# EAGLE design L1Demoscene_v2 (EAGLE 6.5.0)

## Sheet 1 of 2
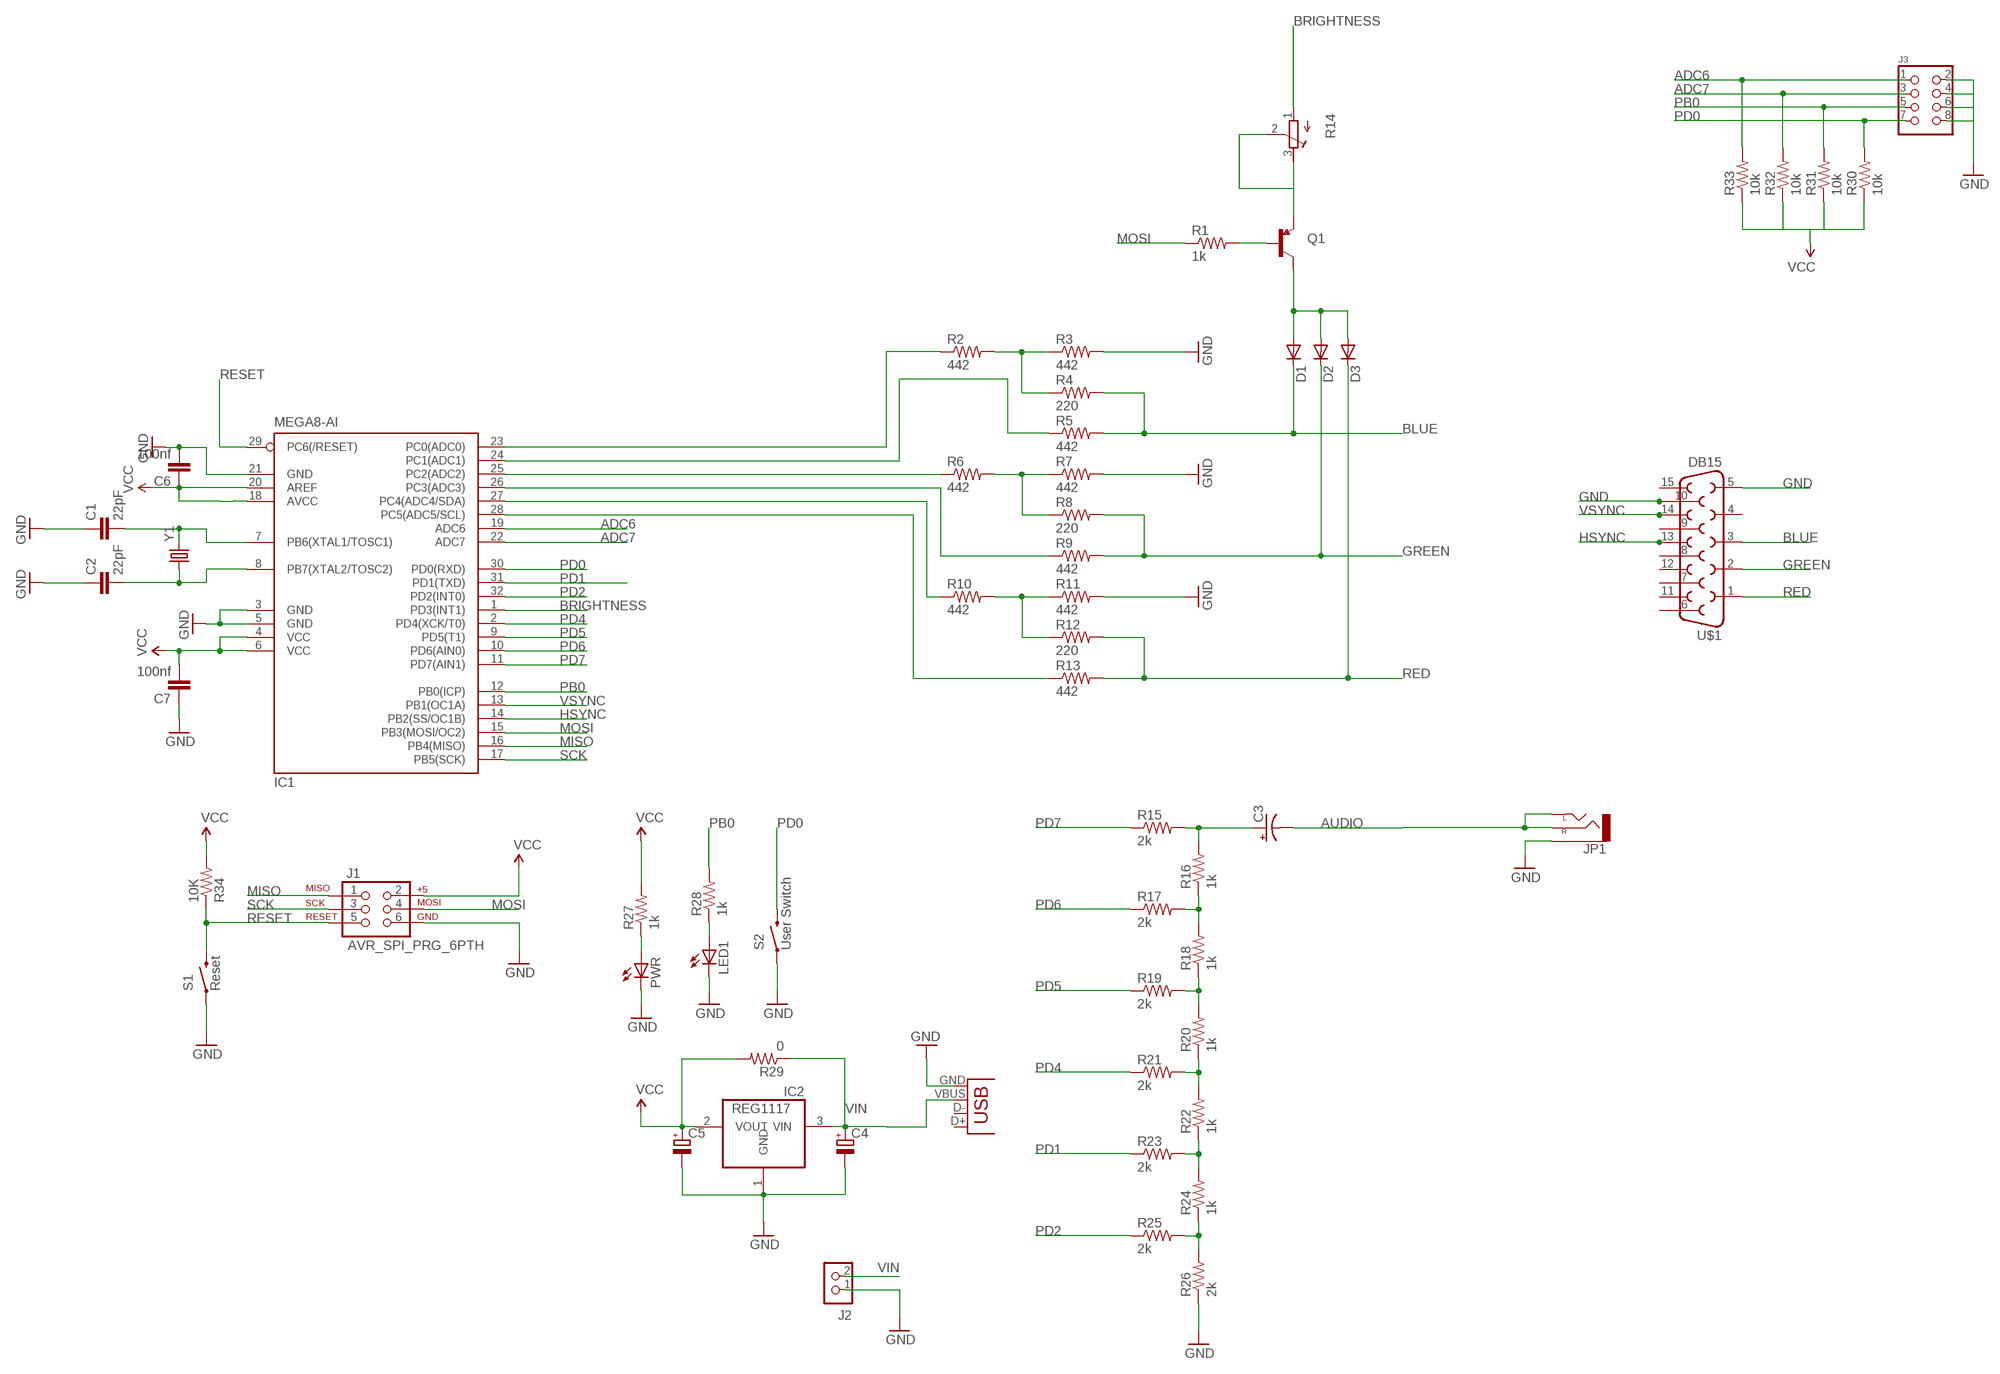
[diagram p0: schematic, sheet 1]

### Parts
10K  R34  RESISTOR0603-RES  [0603-RES]
C1  22pF  CAP0603-CAP  [0603-CAP]
C2  22pF  CAP0603-CAP  [0603-CAP]
C3  CAP_POL1206  [EIA3216]
C4  CAPACITOR_POL-SMC_A  [SMC_A]
C5  CAPACITOR_POL-SMC_A  [SMC_A]
C6  100nf  CAP0603-CAP  [0603-CAP]
C7  100nf  CAP0603-CAP  [0603-CAP]
D1  DIODESOD  [SOD-323]
D2  DIODESOD  [SOD-323]
D3  DIODESOD  [SOD-323]
IC1  MEGA8-AI  [TQFP32-08]
IC2  REG1117  [SOT223]
J1  AVR_SPI_PRG_6PTH  [2X3]
J2  CON_HEADER_1X02-PTH  [M1X2]
J3  CON_HEADER_2X04-PTH  [M2X4]
JP1  AUDIO-JACKPTH  [AUDIO-JACK]
LED1  LED-0603  [LED-603]
PWR  LED-0603  [LED-603]
Q1  TRANSISTOR_PNPSMD  [SOT23-3]
R1  1k  RESISTOR0603-RES  [0603-RES]
R2  442  RESISTOR0603-RES  [0603-RES]
R3  442  RESISTOR0603-RES  [0603-RES]
R4  220  RESISTOR0603-RES  [0603-RES]
R5  442  RESISTOR0603-RES  [0603-RES]
R6  442  RESISTOR0603-RES  [0603-RES]
R7  442  RESISTOR0603-RES  [0603-RES]
R8  220  RESISTOR0603-RES  [0603-RES]
R9  442  RESISTOR0603-RES  [0603-RES]
R10  442  RESISTOR0603-RES  [0603-RES]
R11  442  RESISTOR0603-RES  [0603-RES]
R12  220  RESISTOR0603-RES  [0603-RES]
R13  442  RESISTOR0603-RES  [0603-RES]
R14  R-TRIMM3296W  [RTRIM3296W]
R15  2k  RESISTOR0603-RES  [0603-RES]
R16  1k  RESISTOR0603-RES  [0603-RES]
R17  2k  RESISTOR0603-RES  [0603-RES]
R18  1k  RESISTOR0603-RES  [0603-RES]
R19  2k  RESISTOR0603-RES  [0603-RES]
R20  1k  RESISTOR0603-RES  [0603-RES]
R21  2k  RESISTOR0603-RES  [0603-RES]
R22  1k  RESISTOR0603-RES  [0603-RES]
R23  2k  RESISTOR0603-RES  [0603-RES]
R24  1k  RESISTOR0603-RES  [0603-RES]
R25  2k  RESISTOR0603-RES  [0603-RES]
R26  2k  RESISTOR0603-RES  [0603-RES]
R27  1k  RESISTOR0603-RES  [0603-RES]
R28  1k  RESISTOR0603-RES  [0603-RES]
R29  0  RESISTOR1206  [1206]
R30  10k  RESISTOR0603-RES  [0603-RES]
R31  10k  RESISTOR0603-RES  [0603-RES]
R32  10k  RESISTOR0603-RES  [0603-RES]
R33  10k  RESISTOR0603-RES  [0603-RES]
S1  Reset  SPARKFUN-ELECTROMECHANICAL_SWITCH-MOMENTARY-2-SMD-1101NE  [SPARKFUN-ELECTROMECHANICAL_TACTILE-SWITCH-1101NE]
S2  User Switch  SPARKFUN-ELECTROMECHANICAL_SWITCH-MOMENTARY-2-SMD-1101NE  [SPARKFUN-ELECTROMECHANICAL_TACTILE-SWITCH-1101NE]
U$1  DB15  [DB15]
X1  USB-MICROB  [USB-MICROB]
Y1  CRYSTALHC49US  [HC49US]

### Nets
ADC6: IC1.19(ADC6) J3.1 R33.2
ADC7: IC1.22(ADC7) J3.3 R32.2
AUDIO: C3.C(-) JP1.RING(RIGHT) JP1.TIP(LEFT)
BLUE: D1.1(C) R4.2 R5.2 U$1.3
BRIGHTNESS: IC1.1(PD3(INT1)) R14.1(A)
GND: C1.1 C2.1 C4.- C5.- C6.2 C7.1 IC1.3(GND) IC1.5(GND) IC1.21(GND) IC2.1(GND) J1.6 J2.1 J3.2 J3.4 J3.6 J3.8 JP1.SLEEVE LED1.C PWR.C R3.2 R7.2 R11.2 R26.1 S1.P$1 S2.P$1 U$1.5 U$1.10 X1.GND
GREEN: D2.1(C) R8.2 R9.2 U$1.2
HSYNC: IC1.14(PB2(SS/OC1B)) U$1.13
MISO: IC1.16(PB4(MISO)) J1.1
MOSI: IC1.15(PB3(MOSI/OC2)) J1.4 R1.1
N$1: C1.2 IC1.7(PB6(XTAL1/TOSC1)) Y1.2
N$2: C2.2 IC1.8(PB7(XTAL2/TOSC2)) Y1.1
N$3: IC1.23(PC0(ADC0)) R2.1
N$4: R2.2 R3.1 R4.1
N$5: D1.2(A) D2.2(A) D3.2(A) Q1.3(C)
N$6: Q1.1(B) R1.2
N$7: IC1.24(PC1(ADC1)) R5.1
N$8: IC1.25(PC2(ADC2)) R6.1
N$9: R6.2 R7.1 R8.1
N$10: PWR.A R27.1
N$11: IC1.26(PC3(ADC3)) R9.1
N$12: IC1.28(PC5(ADC5/SCL)) R13.1
N$13: LED1.A R28.1
N$14: IC1.27(PC4(ADC4/SDA)) R10.1
N$15: R10.2 R11.1 R12.1
N$16: Q1.2(E) R14.2(S) R14.3(E)
N$21: C3.A(+) R15.2 R16.2
N$22: R16.1 R17.2 R18.2
N$23: R18.1 R19.2 R20.2
N$24: R20.1 R21.2 R22.2
N$25: R22.1 R23.2 R24.2
N$26: R24.1 R25.2 R26.2
PB0: IC1.12(PB0(ICP)) J3.5 R28.2 R31.2
PD0: IC1.30(PD0(RXD)) J3.7 R30.2 S2.P$2
PD1: IC1.31(PD1(TXD)) R23.1
PD2: IC1.32(PD2(INT0)) R25.1
PD4: IC1.2(PD4(XCK/T0)) R21.1
PD5: IC1.9(PD5(T1)) R19.1
PD6: IC1.10(PD6(AIN0)) R17.1
PD7: IC1.11(PD7(AIN1)) R15.1
RED: D3.1(C) R12.2 R13.2 U$1.1
RESET: 10K.1 IC1.29(PC6(/RESET)) J1.5 S1.P$2
SCK: IC1.17(PB5(SCK)) J1.3
VCC: 10K.2 C5.+ C6.1 C7.2 IC1.4(VCC) IC1.6(VCC) IC1.18(AVCC) IC1.20(AREF) IC2.2(VOUT) J1.2 R27.2 R29.2 R30.1 R31.1 R32.1 R33.1
VIN: C4.+ IC2.3(VIN) J2.2 R29.1 X1.VBUS
VSYNC: IC1.13(PB1(OC1A)) U$1.14
Unconnected: U$1.4 U$1.6 U$1.7 U$1.8 U$1.9 U$1.11 U$1.12 U$1.15 X1.D+ X1.D-

## Sheet 2 of 2

## Library data of the parts
10K R1-R13 R15-R33 = SparkFun-Resistors:RESISTOR: Resistor Basic schematic elements and footprints for 0603, 1206, and PTH resistors.
C1 C2 C6 C7 = SparkFun-Capacitors:CAP: Capacitor Standard 0603 ceramic capacitor, and 0.1" leaded capacitor.
C3 = SparkFun-Capacitors:CAP_POL: Capacitor Polarized These are standard SMD and PTH capacitors. Normally 10uF, 47uF, and 100uF in electrolytic and tantalum varieties. Always verify the external diameter of the through hole cap, it varies with capacity, voltage, and manufacturer. The EIA devices should be standard.
C4 C5 = dp_devices:CAPACITOR_POL: Polarized capacitor in various packages
D1-D3 = SparkFun-DiscreteSemi:DIODE: Diode These are standard reverse protection diodes and small signal diodes. SMA package can handle up to about 1A. SOD-323 can handle about 200mA. What the SOD-323 package when ordering, there are some mfgs out there that are 5-pin packages.; PROD_ID: DIO-09646
IC1 = atmel:MEGA8: MICROCONTROLLER 8 Kbytes FLASH, 1 kbytes SRAM, 512 bytes EEPROM, USART, 6-channel 10 bit ADC, 2-channel 8 bit ADC Pin compatible with Atmega48, ATMega88, ATMega168 Source: avr.lbr; MPN: ATMEGA8-16AU; OC_FARNELL: 9171371; OC_NEWARK: 73M8863
IC2 = burr-brown:REG1117: 800mA and 1A Low Dropout (LDO) Positive Regulator 1.8V, 2.5V, 2.85V, 3.3V, 5V, and Adj; MPN: REG1117; OC_FARNELL: 1097566; OC_NEWARK: 14P6981
J1 = SparkFun-Connectors:AVR_SPI_PRG_6: AVR ISP 6 Pin This is the reduced ISP connector for AVR programming. Common on Arduino. This footprint will take up less PCB space and can be used with a 10-pin to 6-pin adapter such as SKU: BOB-08508
J2 = dp_devices:CON_HEADER_1X02
J3 = dp_devices:CON_HEADER_2X04
JP1 = SparkFun-Connectors:AUDIO-JACK: 3.5mm Audio Jack Simple 3.5mm common PCB mount audio jack. SKU: PRT-08032
LED1 PWR = dp_devices:LED: Light Emitting Diode
Q1 = SparkFun-DiscreteSemi:TRANSISTOR_PNP: Generic PNP BJT Double check pinouts against datasheets- not all devices are the same! MMBT3906 - 40V 200mA SOT-23 (TRANS-08052) MMBT4403 - 40V 600mA SOT-23 (TRANS-09245)
R14 = rcl:R-TRIMM: Trimm resistor
S1 S2 = tvbgone-2layer:SPARKFUN-ELECTROMECHANICAL_SWITCH-MOMENTARY-2: Various NO switches- pushbuttons, reed, etc
U$1 = SparkFun-Connectors:DB15: DB15 / VGA right angle through-hole female connector.
X1 = STM32-PROX:USB: USB Connectors USB-B-PTH is fully proven SKU : PRT-00139 USB-miniB is fully proven SKU : PRT-00587 USB-A-PCB is untested. USB-A-H is throughly reviewed, but untested. Spark Fun Electronics SKU : PRT-00437 USB-B-SMT is throughly reviewed, but untested. Needs silkscreen touching up. USB-A-S has not been used/tested USB-MB-H has not been used/tested
Y1 = SparkFun-FreqCtrl:CRYSTAL: Various standard crystals. Proven footprints. Spark Fun Electronics SKU : COM-00534

## Board
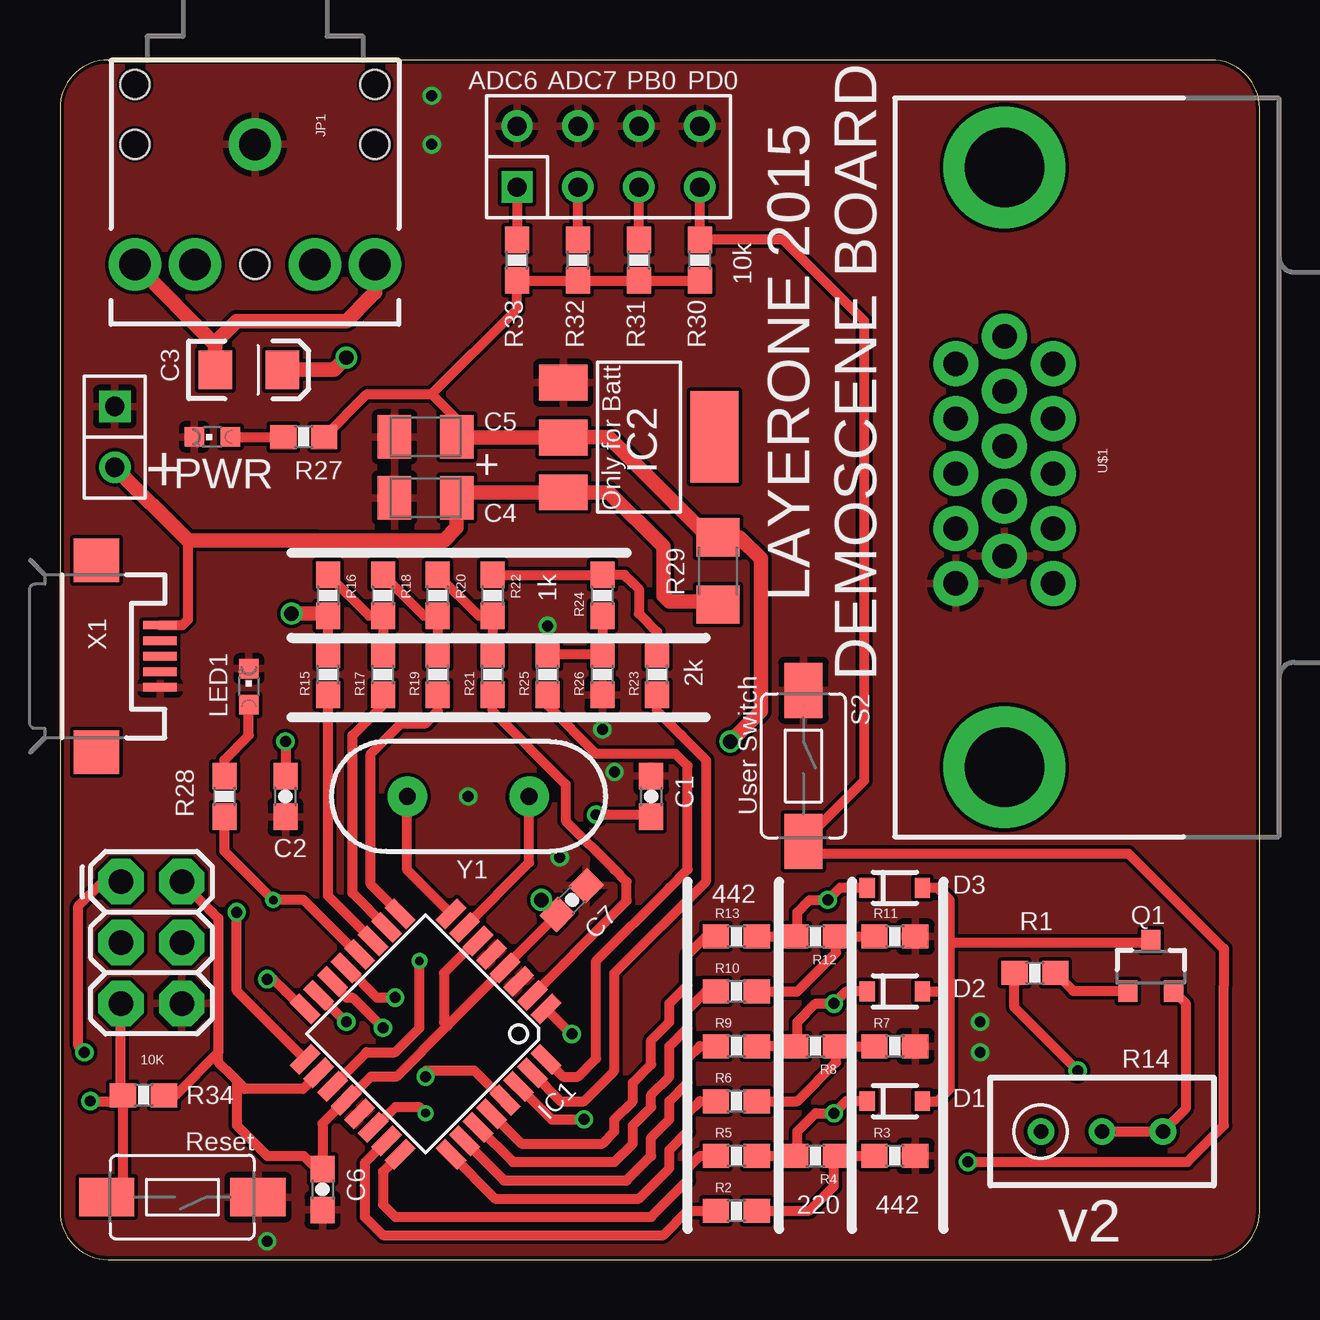
[diagram p1: board, top side]
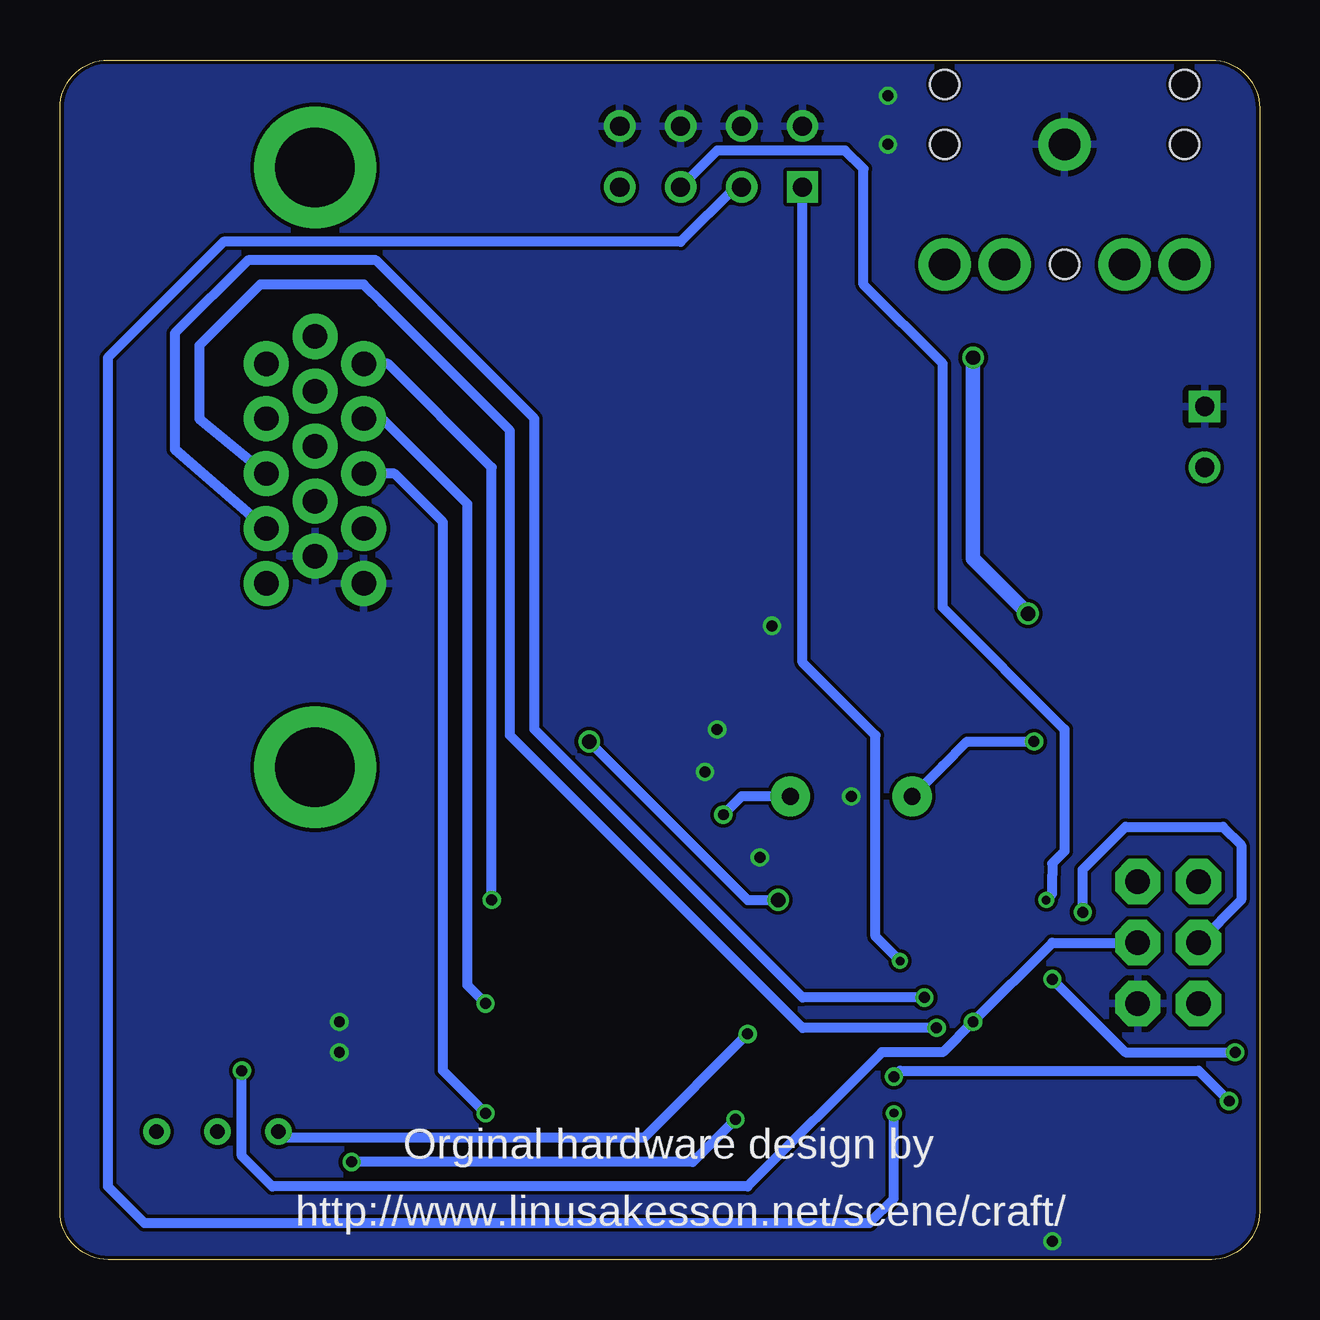
[diagram p2: board, bottom side, seen from below]

Size 50 x 50 mm. Coordinates in mm from the lower left corner, seen from the top.
Outline: 50,2 50,48 arc90 48,50 2,50 arc90 0,48 0,2 arc90 2,0 48,0 arc90 50,2
Copper layers (1*16): Top 0.035mm / dielectric 1.5mm / Bottom 0.035mm
Design rules "hackvana": minimum track width 6mil, minimum drill 0.3mm, track to track 6mil, track to pad 6mil, pad to pad 6mil, via to via 6mil, smd to smd 0mil, copper to edge 6mil, drill to drill 6mil, minimum pad ring 10mil, minimum via ring 6mil, stop-mask expansion 2mil, vias tented up to drill 100mil, thermal gap 10mil

### Footprints (pad centres in the part's own frame; a part is rotated, then mirrored left to right if it is on the bottom)
0603-RES = smd 1.1 x 1: 1 -0.85,0; 2 0.85,0
0603-CAP = smd 1.1 x 1: 1 -0.85,0; 2 0.85,0
EIA3216 = smd 1.4 x 1.6: A 1.4,0; C -1.4,0
SMC_A = smd 1.4 x 1.8: + -1.3,0; - 1.3,0
SOD-323 = smd 0.63 x 0.83: 1 -1.15,0; 2 1.15,0
TQFP32-08 = smd 1.27 x 0.559: 1 -4.293,2.8; 2 -4.293,2; 3 -4.293,1.2; 4 -4.293,0.4; 5 -4.293,-0.4; 6 -4.293,-1.2; 7 -4.293,-2; 8 -4.293,-2.8; 17 4.293,-2.8; 18 4.293,-2; 19 4.293,-1.2; 20 4.293,-0.4; 21 4.293,0.4; 22 4.293,1.2; 23 4.293,2; 24 4.293,2.8 | smd 0.559 x 1.27: 9 -2.8,-4.293; 10 -2,-4.293; 11 -1.2,-4.293; 12 -0.4,-4.293; 13 0.4,-4.293; 14 1.2,-4.293; 15 2,-4.293; 16 2.8,-4.293; 25 2.8,4.293; 26 2,4.293; 27 1.2,4.293; 28 0.4,4.293; 29 -0.4,4.293; 30 -1.2,4.293; 31 -2,4.293; 32 -2.8,4.293
SOT223 = smd 1.499 x 2.007: 1 -2.261,-3.15; 2 0.025,-3.15; 3 2.311,-3.15 | smd 3.81 x 2.007: 4 0,3.15
2X3 = drill 1.016 pad 1.88 octagon: 1 0,0; 2 0,2.54; 3 2.54,0; 4 2.54,2.54; 5 5.08,0; 6 5.08,2.54
M1X2 = drill 0.8 square: 1 -1.27,0 | drill 0.8: 2 1.27,0
M2X4 = drill 0.8 square: 1 -3.81,-1.27 | drill 0.8: 2 -3.81,1.27; 3 -1.27,-1.27; 4 -1.27,1.27; 5 1.27,-1.27; 6 1.27,1.27; 7 3.81,-1.27; 8 3.81,1.27
AUDIO-JACK = drill 1.3 pad 2.184: RING 5,5; RSH 5,2.5; SLEEVE 0,0; TIP 5,-5; TSH 5,-2.5 | hole 1.2: 0,5; -2.5,5; -2.5,-5; 0,-5; 5,0
LED-603 = smd 0.8 x 0.8: A 0,-0.75; C 0,0.75
SOT23-3 = smd 0.8 x 0.9: 1 -0.95,-1; 2 0.95,-1; 3 0,1.1
RTRIM3296W = drill 0.61: 1 0,-2.54; 2 0,0; 3 0,2.54
1206 = smd 1.6 x 1.8: 1 -1.4,0; 2 1.4,0
SPARKFUN-ELECTROMECHANICAL_TACTILE-SWITCH-1101NE = smd 2.3 x 1.6: P$1 -3.15,0; P$2 3.15,0
DB15 = drill 1.016 pad 1.88: 1 -4.32,-7.112; 2 -2.03,-7.112; 3 0.26,-7.112; 4 2.55,-7.112; 5 4.84,-7.112; 6 -5.46,-5.08; 7 -3.17,-5.08; 8 -0.88,-5.08; 9 1.41,-5.08; 10 3.7,-5.08; 11 -4.32,-3.048; 12 -2.03,-3.048; 13 0.26,-3.048; 14 2.55,-3.048; 15 4.84,-3.048 | drill 3.302 pad 5.08: G1 -12.5,-5.08; G2 12.5,-5.08
USB-MICROB = smd 0.35 x 1.4: D+ 0,2.65; D- -0.65,2.65; GND 1.3,2.65; ID 0.65,2.65; VBUS -1.3,2.65 | smd 1.8 x 1.9: MT1 -4,0; MT2 4,0
HC49US = drill 0.7 pad 1.651: 1 -2.54,0; 2 2.54,0

### Placement (x,y rotation side)
10K  3.48,6.85 0 top
C1  24.64,19.3 270 top
C2  9.4,19.3 90 top
C3  7.87,37.08 0 top
C4  15.24,31.75 180 top
C5  15.24,34.29 180 top
C6  10.95,2.92 270 top
C7  21.34,14.99 225 top
D1  34.8,6.6 0 top
D2  34.8,11.18 0 top
D3  34.8,15.49 0 top
IC1  15.24,9.4 225 top
IC2  24.13,34.29 270 top
J1  2.54,15.75 270 top
J2  2.29,34.29 270 top
J3  22.86,45.97 0 top
JP1  8.13,46.48 270 top
LED1  7.87,23.88 0 top
PWR  6.35,34.29 90 top
Q1  45.47,12.19 0 top
R1  40.64,11.94 0 top
R2  28.19,2.03 0 top
R3  34.8,4.32 0 top
R4  31.5,4.32 180 top
R5  28.19,4.32 0 top
R6  28.19,6.6 0 top
R7  34.8,8.89 0 top
R8  31.5,8.89 180 top
R9  28.19,8.89 0 top
R10  28.19,11.18 0 top
R11  34.8,13.46 0 top
R12  31.5,13.46 180 top
R13  28.19,13.46 0 top
R14  43.43,5.33 270 top
R15  11.18,24.38 90 top
R16  11.18,27.69 270 top
R17  13.46,24.38 90 top
R18  13.46,27.69 270 top
R19  15.75,24.38 90 top
R20  15.75,27.69 270 top
R21  18.03,24.38 90 top
R22  18.03,27.69 270 top
R23  24.89,24.38 90 top
R24  22.61,27.69 90 top
R25  20.32,24.38 90 top
R26  22.61,24.38 90 top
R27  10.16,34.29 0 top
R28  6.86,19.3 270 top
R29  27.43,28.7 90 top
R30  26.67,41.66 90 top
R31  24.13,41.66 90 top
R32  21.59,41.66 90 top
R33  19.05,41.66 90 top
S1  5.1,2.6 180 top
S2  30.99,20.57 270 top
U$1  44.45,33.02 270 top
X1  1.52,25.15 270 top
Y1  17.02,19.3 0 top

### Tracks (layer width: path | path; a pad name or v marks a point on that pad's centre or on a via)
ADC6  (via drill 0.36)
  Top 0.406: IC1.19 12.78,8.64 13.97,8.64 14.99,9.65 v14.99,12.45 | J3.1 R33.2
  Bottom 0.406: v14.99,12.45 16,13.46 16,21.84 19.05,24.89 J3.1
ADC7  (via drill 0.36)
  Top 0.406: v15.24,6.1 14.99,6.35 13.97,6.35 13.13,5.51 IC1.22 | R32.2 J3.3
  Bottom 0.406: v15.24,6.1 15.24,2.54 16.26,1.52 46.48,1.52 48.01,3.05 48.01,37.59 43.18,42.42 24.13,42.42 21.84,44.7 J3.3
AUDIO
  Top 0.61: C3.C 6.47,38.14 | 6.47,38.14 JP1.TIP | JP1.RING 13.13,40.31 12.95,40.13 11.94,39.12 7.37,39.12 6.47,38.22 6.47,38.14
BLUE  (via drill 0.46)
  Top 0.406: R5.2 R4.2 30.73,4.41 30.73,5.33 31.5,6.1 v32.26,6.1 32.77,6.6 D1.1
  Bottom 0.406: v32.26,6.1 34.04,7.87 34.04,30.73 36.06,32.76 U$1.3
BRIGHTNESS  (via drill 0.46)
  Top 0.406: IC1.1 21.31,9.4 v21.34,9.4
  Bottom 0.406: v21.34,9.4 25.65,5.08 37.85,5.08 40.64,5.08 R14.1
GND  (via drill 0.46)
  other vias: 20.83,16.76 17.02,19.3 23.11,20.32 20.32,26.42 8.64,0.76 38.35,8.64 38.35,9.91 15.49,48.51 15.49,46.48 22.61,22.1
  pour Bottom: 0,0 50,0 50,50 0,50
  pour Top: 0,0 50,0 50,50 0,50
GREEN  (via drill 0.46)
  Top 0.406: R9.2 R8.2 30.73,8.98 30.73,9.91 31.5,10.67 v32.26,10.67 32.77,11.18 D2.1
  Bottom 0.406: v32.26,10.67 33.02,11.43 33.02,31.5 36.57,35.05 U$1.2
HSYNC  (via drill 0.46)
  Top 0.406: IC1.14 11.36,11.5 11.94,10.92 12.19,10.92 v13.46,9.65
  Bottom 0.406: v13.46,9.65 19.05,9.65 31.24,21.84 31.24,34.54 36.58,39.88 37.34,40.64 41.66,40.64 44.2,38.1 44.2,35.05 U$1.13
MISO  (via drill 0.46)
  Top 0.406: IC1.16 10.12,10.45 9.4,11.18 8.89,11.68 v8.64,11.68 | v1.02,8.64 0.76,8.89 0.76,14.73 1.78,15.75 J1.1
  Bottom 0.406: v8.64,11.68 5.59,8.64 v1.02,8.64
MOSI  (via drill 0.46)
  Top 0.406: IC1.15 11.9,9.91 v11.94,9.91 | v42.42,7.87 41.57,8.72 39.79,10.5 R1.1
  Bottom 0.406: J1.4 8.64,13.21 v11.94,9.91 13.21,8.64 15.75,8.64 21.34,3.05 41.15,3.05 42.42,4.32 v42.42,7.87
N$1  (via drill 0.46)
  Top 0.406: IC1.7 19.56,16.54 Y1.2 | v22.35,18.54 24.64,18.54 C1.2
  Bottom 0.406: Y1.2 21.59,19.3 v22.35,18.54
N$2  (via drill 0.46)
  Top 0.406: IC1.8 14.48,16.23 Y1.1 | v9.4,21.59 C2.2
  Bottom 0.406: Y1.1 13.21,20.57 12.19,21.59 v9.4,21.59
N$3
  Top 0.406: IC1.23 12.7,4.03 12.7,1.78 13.46,1.02 25.15,1.02 26.16,2.03 R2.1
N$4
  Top 0.406: R2.2 31.24,2.03 32.26,3.05 32.26,4.23 R4.1 R3.1
N$5
  Top 0.406: D1.2 36.58,6.6 37.08,7.11 37.08,11.18 | 37.08,11.18 37.08,13.21 | 37.08,13.21 37.08,14.99 36.58,15.49 D3.2 | D2.2 37.08,11.18 | Q1.3 45.38,13.21 37.08,13.21
N$6
  Top 0.406: R1.2 42.24,11.19 Q1.1
N$7
  Top 0.406: IC1.24 13.46,3.66 13.46,2.29 13.97,1.78 24.64,1.78 26.16,3.3 26.16,3.81 26.67,4.32 R5.1
N$8
  Top 0.406: IC1.25 18.14,2.54 24.13,2.54 25.4,3.81 25.4,4.57 26.16,5.33 26.16,6.1 26.67,6.6 R6.1
N$9
  Top 0.406: R6.2 30.73,6.6 32.35,8.22 R8.1 R7.1
N$10
  Top 0.406: PWR.A R27.1
N$11
  Top 0.406: IC1.26 18.51,3.3 23.62,3.3 24.64,4.32 24.64,5.08 25.4,5.84 25.4,6.6 26.16,7.37 26.16,8.38 26.67,8.89 R9.1
N$12
  Top 0.406: IC1.28 19.25,4.83 22.61,4.83 23.11,5.33 23.11,5.84 23.88,6.6 23.88,7.37 24.64,8.13 24.64,9.14 25.4,9.91 25.4,10.67 26.16,11.43 26.16,12.7 26.92,13.46 R13.1
N$13
  Top 0.406: R28.1 6.86,20.83 7.87,21.84 LED1.A
N$14
  Top 0.406: IC1.27 18.88,4.06 23.11,4.06 23.88,4.83 23.88,5.59 24.64,6.35 24.64,6.86 25.4,7.62 25.4,8.89 26.16,9.65 26.16,10.41 26.92,11.18 R10.1
N$15
  Top 0.406: R10.2 30.73,11.18 32.35,12.79 R12.1 R11.1
N$16
  Top 0.406: R14.2 R14.3 46.92,6.28 46.92,10.68 Q1.2
N$21  (via drill 0.6)
  Top 0.406: R15.2 R16.2
  Top 0.61: R16.2 11.09,26.92 v9.65,26.92 | C3.A 11.43,37.08 v11.94,37.59
  Bottom 0.61: v9.65,26.92 11.94,29.21 v11.94,37.59
N$22
  Top 0.406: R17.2 R18.2 12.88,26.84 R16.1
N$23
  Top 0.406: R19.2 R20.2 15.16,26.84 R18.1
N$24
  Top 0.406: R21.2 R22.2 17.45,26.84 R20.1
N$25
  Top 0.406: R22.1 R24.2 23.53,28.54 23.88,28.19 24.13,27.94 24.13,26.92 24.89,26.16 R23.2 24.88,25.25
N$26
  Top 0.406: R25.2 R26.2 R24.1
PB0  (via drill 0.36)
  Top 0.406: IC1.12 12.43,12.72 10.16,14.99 v8.89,14.99 6.86,17.02 R28.2 | R31.2 J3.5
  Bottom 0.406: v8.89,14.99 8.64,15.24 8.64,16 8.64,16.51 8.13,17.02 8.13,22.1 13.21,27.18 13.21,37.34 16.51,40.64 16.51,45.47 17.27,46.23 22.61,46.23 J3.5
PD0  (via drill 0.46)
  Top 0.406: IC1.30 20.49,5.84 v21.84,5.84 | v37.85,4.06 46.99,4.06 48.51,5.59 48.51,11.43 48.51,12.95 44.55,16.92 31.5,16.92 S2.P$2 33.53,19.96 33.53,39.12 30.14,42.51 R30.2 J3.7
  Bottom 0.406: v21.84,5.84 23.62,4.06 v37.85,4.06
PD1
  Top 0.406: IC1.31 20.86,6.6 21.84,6.6 23.11,7.87 23.11,11.94 26.92,15.75 26.92,20.83 25.91,21.84 24.89,22.86 R23.1
PD2
  Top 0.406: IC1.32 20.98,7.62 21.59,7.62 22.35,8.38 22.35,12.45 25.4,15.49 26.16,16.26 26.16,20.57 25.65,21.08 22.35,21.08 20.32,23.11 R25.1
PD4
  Top 0.406: R21.1 18.03,22.86 21.08,19.81 21.08,18.29 23.11,16.26 23.62,15.75 23.62,14.95 23.11,14.44 IC1.2
PD5
  Top 0.406: IC1.9 12.95,15.64 12.95,21.08 14.22,22.35 15.24,22.35 15.75,22.86 R19.1
PD6
  Top 0.406: IC1.10 12.19,15.27 12.19,21.84 13.46,23.11 R17.1
PD7
  Top 0.406: IC1.11 11.18,15.16 R15.1
RED  (via drill 0.46)
  Top 0.406: R13.2 R12.2 30.73,13.55 30.73,14.48 31.24,14.99 v32,14.99 32.51,15.49 D3.1
  Bottom 0.406: v32,14.99 32,33.02 36.32,37.34 U$1.1
RESET  (via drill 0.46)
  Top 0.406: S1.P$2 2.63,3.28 10K.1 | 10K.1 2.54,6.95 J1.5 | IC1.29 18.5,6.65 17.27,7.87 15.24,7.87 v15.24,7.62 | v1.27,6.6 2.38,6.6 10K.1
  Bottom 0.406: v15.24,7.62 14.99,7.87 2.54,7.87 v1.27,6.6
SCK  (via drill 0.46)
  Top 0.406: IC1.17 7.37,11.2 v7.37,14.48
  Bottom 0.406: v7.37,14.48 7.37,16.26 5.59,18.03 1.52,18.03 0.76,17.27 0.76,14.99 J1.3
VCC  (via drill 0.6)
  Top 0.406: J1.2 6.35,14.48 6.6,14.22 6.6,8.64 | 6.6,8.64 4.82,6.85 10K.2 | 16.16,9.75 IC1.4 18.56,12.21 C7.2 20.67,14.38 v20.07,14.99 | 16.16,9.75 14.03,7.62 12.95,7.62 11.98,6.65 IC1.20 11.53,6.25 10.95,5.67 C6.1 10.71,3.77 10.16,4.32 8.64,4.32 7.37,5.59 7.37,7.27 7.37,7.46 7.16,7.67 | IC1.6 17.35,13.28 16,11.94 16,9.91 16.16,9.75 | R27.2 12.79,36.07 15.49,36.07 | 15.49,36.07 16.54,35.02 C5.+ | 6.6,8.64 6.6,8.22 7.16,7.67 | IC1.18 10.13,7.11 7.72,7.11 7.16,7.67 | 15.49,36.07 19.05,39.62 R33.1 R32.1 R31.1 R30.1
  Top 0.61: C5.+ 16.57,34.27 IC2.2 21.01,34.29 22.86,34.29 27.05,30.1 R29.2 28.32,30.1 29.21,29.21 29.21,22.86 v27.94,21.59
  Bottom 0.406: v27.94,21.59 21.34,14.99 v20.07,14.99
VIN
  Top 0.406: 5.33,29.97 5.33,26.67 5.11,26.45 X1.VBUS
  Top 0.61: IC2.3 21.01,32 | IC2.3 16.77,31.98 C4.+ 16.54,30.51 16,29.97 10.67,29.97 | 10.41,29.97 10.67,29.97 | R29.1 27.3,27.43 25.4,27.43 25.15,27.69 25.15,29.72 22.89,31.98 IC2.3 | 10.67,29.97 5.33,29.97 J2.2
VSYNC  (via drill 0.46)
  Top 0.406: IC1.13 11.98,12.15 13.21,10.92 v13.97,10.92
  Bottom 0.406: v13.97,10.92 19.05,10.92 30.23,22.1 30.23,35.05 36.83,41.66 42.16,41.66 45.21,38.61 45.21,33.77 U$1.14

### Text on the board
tPlace: ADC6 | ADC7 | PB0 | PD0 | + | + | Only for Batt | LAYERONE 2015 | DEMOSCENE BOARD | v2
bPlace: Orginal hardware design by | http://www.linusakesson.net/scene/craft/